# EAGLE design LTC3588_Board (EAGLE 7.1.0)
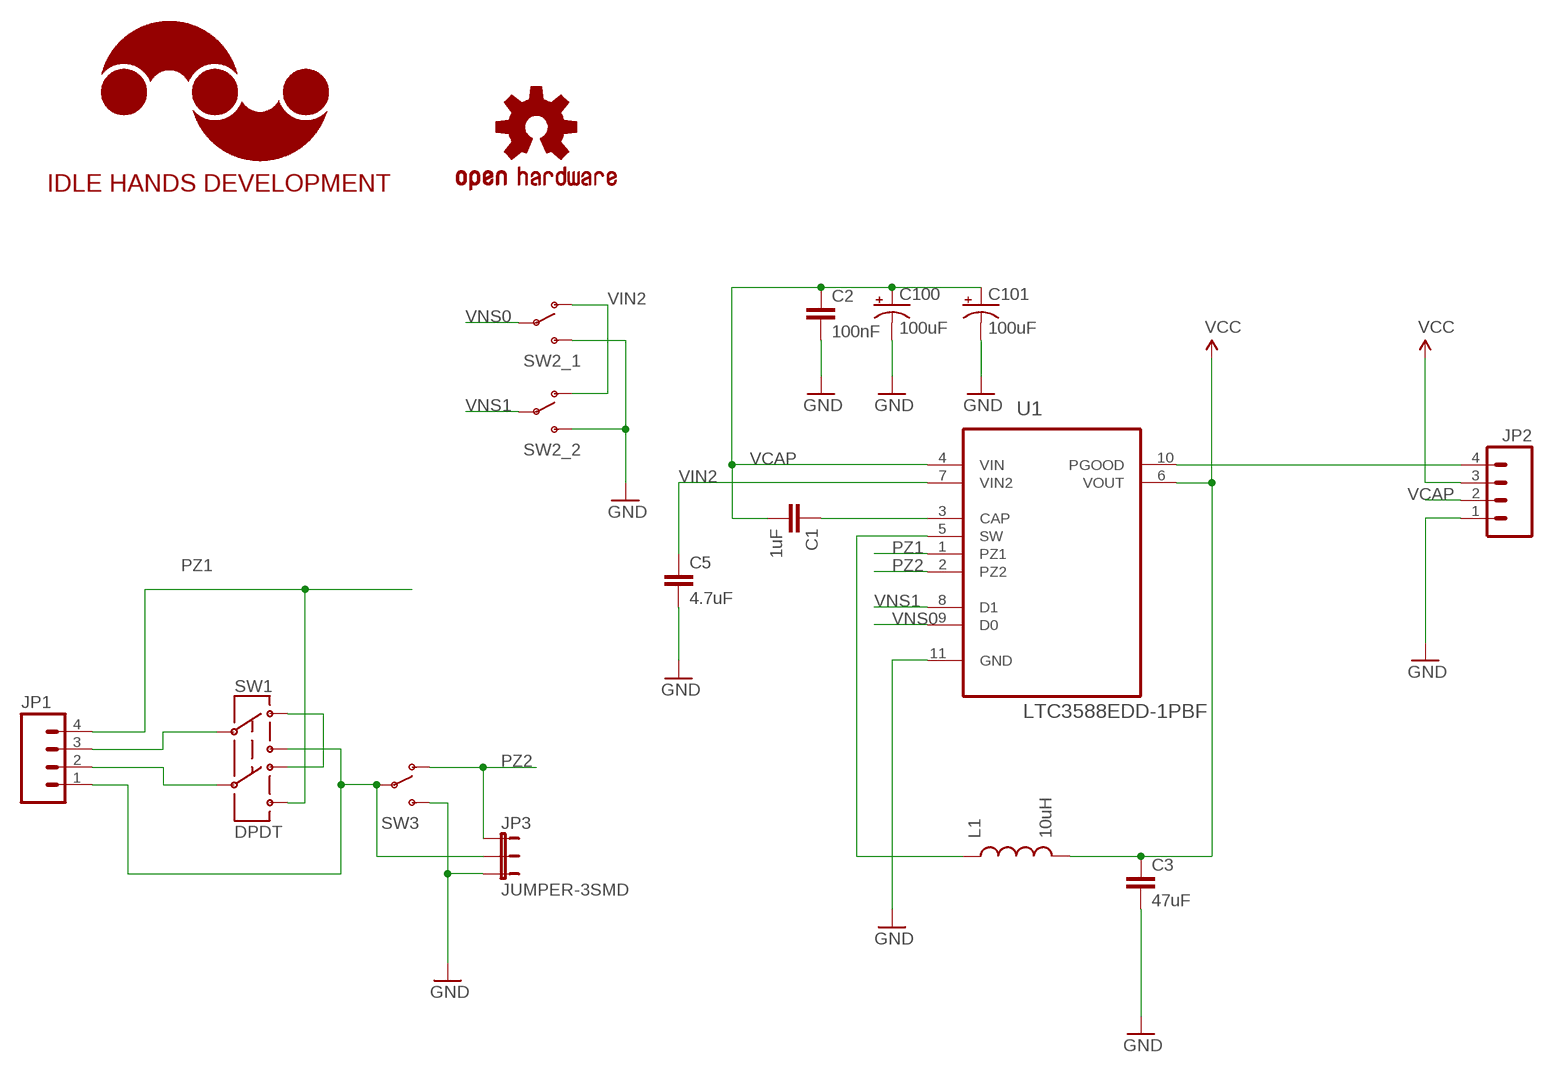
[diagram p0: schematic, sheet 1]

## Parts
C1  1uF  CAP0603-CAP  [0603-CAP]
C2  100nF  CAP0603-CAP  [0603-CAP]
C3  47uF  CAP1206  [1206]
C5  4.7uF  CAP0603-CAP  [0603-CAP]
C100  100uF  CAP_POL7343  [EIA7343]
C101  100uF  CAP_POL7343  [EIA7343]
JP1  M04LOCK  [1X04_LOCK]
JP2  M04LOCK  [1X04_LOCK]
JP3  JUMPER-3SMD  [SJ_3]
L1  10uH  INDUCTOR1210  [1210]
LOGO1  IDLEHANDS_LOGOS  [IHD-LOGO-S]
LOGO2  OSHW-LOGOS  [OSHW-LOGO-S]
SW1  DPDT  SWITCH-DPDTAYZ0202  [AYZ0202]
SW2_1  SWITCH-SPDT  [SWITCH-SPDT-SMD-CK]
SW2_2  SWITCH-SPDT  [SWITCH-SPDT-SMD-CK]
SW3  SWITCH-SPDT  [SWITCH-SPDT-SMD-CK]
U1  LTC3588EDD-1PBF  [DFN300X300X80-11N]

## Nets
GND: C2.2 C3.2 C5.2 C100.C(-) C101.C(-) JP2.1 JP3.3 SW2_1.3(S) SW2_2.3(S) SW3.3(S) U1.11(GND)
N$1: JP1.3 SW1.2
N$2: JP1.2 SW1.5
N$3: SW1.1 SW1.4
N$5: JP1.1 JP3.2 SW1.3 SW3.2(P)
N$13: JP2.4 U1.10(PGOOD)
N$15: C1.1 U1.3(CAP)
N$16: L1.1 U1.5(SW)
PZ1: JP1.4 SW1.6 U1.1(PZ1)
PZ2: JP3.1 SW3.1(O) U1.2(PZ2)
VCAP: C1.2 C2.1 C100.A(+) C101.A(+) JP2.2 U1.4(VIN)
VCC: C3.1 JP2.3 L1.2 U1.6(VOUT)
VIN2: C5.1 SW2_1.1(O) SW2_2.1(O) U1.7(VIN2)
VNS0: SW2_1.2(P) U1.9(D0)
VNS1: SW2_2.2(P) U1.8(D1)

## Library data of the parts
C1-C3 C5 = SparkFun-Passives:CAP: Capacitor Standard 0603 ceramic capacitor, and 0.1" leaded capacitor.
C100 C101 = SparkFun-Passives:CAP_POL: Capacitor Polarized These are standard SMD and PTH capacitors. Normally 10uF, 47uF, and 100uF in electrolytic and tantalum varieties. Always verify the external diameter of the through hole cap, it varies with capacity, voltage, and manufacturer. The EIA devices should be standard.
JP1 JP2 = SparkFun-Connectors:M04: Header 4 Standard 4-pin 0.1" header. Use with straight break away headers (SKU : PRT-00116), right angle break away headers (PRT-00553), swiss pins (PRT-00743), machine pins (PRT-00117), and female headers (PRT-00115). Molex polarized connector foot print use with SKU : PRT-08231 with associated crimp pins and housings. 1MM SMD Version SKU: PRT-10208
JP3 = SparkFun-Passives:JUMPER-3
L1 = SparkFun-Passives:INDUCTOR: Inductors Basic Inductor/Choke - 0603 and 1206. Footprints are not proven and vary greatly between part numbers. SRN6045- 33uH, 20% 1.4A SDR0403-560KL - 56uH, 10%, 500mA RMS/740mA peak
LOGO1 = IdleHandsProject:IDLEHANDS_LOGO: Open Source Hardware Logo This logo indicates the piece of hardware it is found on incorporates a OSHW license and/or adheres to the definition of open source hardware found here: http://freedomdefined.org/OSHW
LOGO2 = SparkFun-Aesthetics:OSHW-LOGO: Open Source Hardware Logo This logo indicates the piece of hardware it is found on incorporates a OSHW license and/or adheres to the definition of open source hardware found here: http://freedomdefined.org/OSHW
SW1 = SparkFun-Electromechanical:SWITCH-DPDT: DPDT Version of the COM-00597; PROD_ID: SWCH-08179
SW2_1 SW2_2 SW3 = SparkFun-Electromechanical:SWITCH-SPDT: SPDT Switch Simple slide switch, Spark Fun Electronics SKU : COM-00102 DPDT SMT slide switch, AYZ0202, SWCH-08179
U1 = LTC_By_element14_Batch_1:LTC3588EDD-1PBF: Piezoelectric Energy Harvesting Power Supply; MPN: LTC3588EDD-1#PBF; OC_FARNELL: 1839153; OC_NEWARK: 63R1665; PACKAGE: DFN-10; SUPPLIER: Linear Technology

## Board
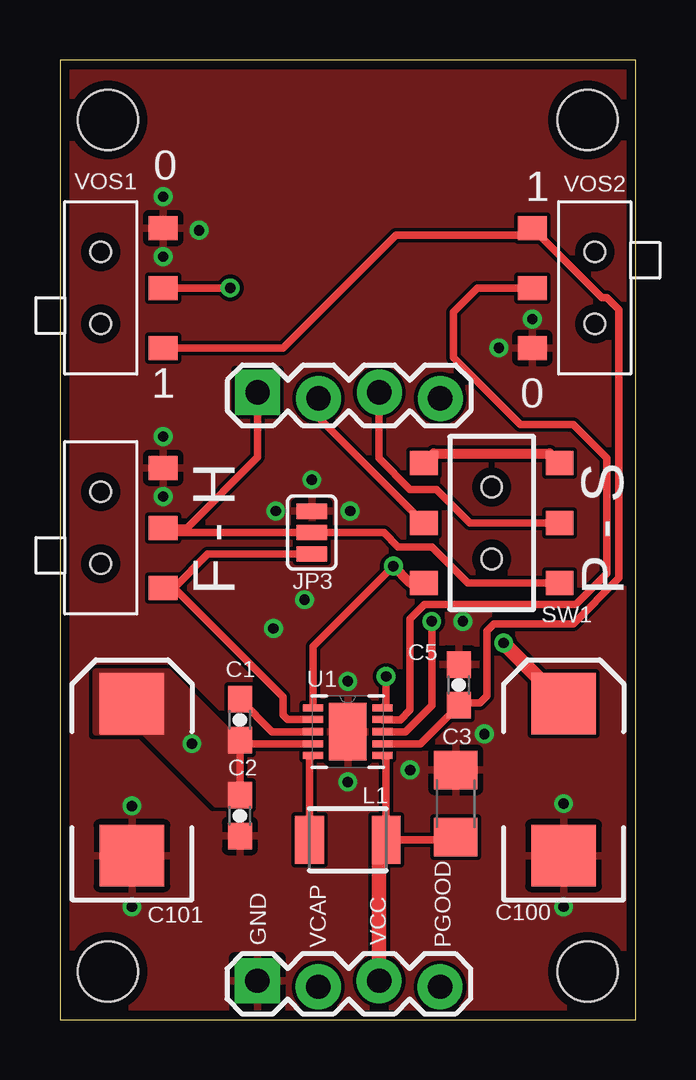
[diagram p1: board, top side]
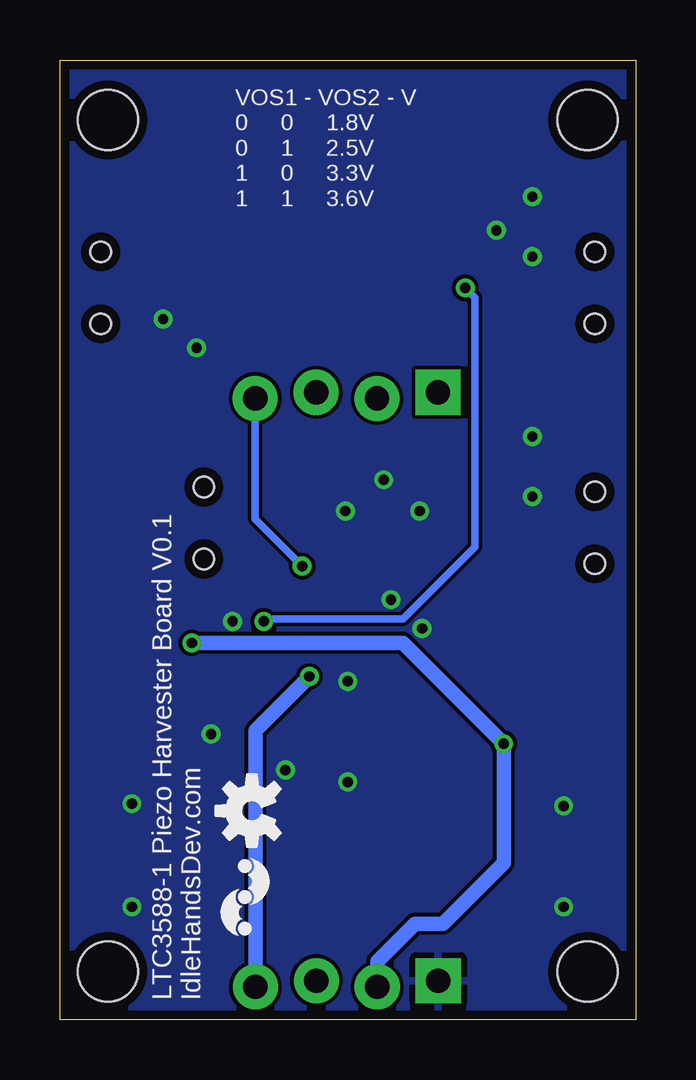
[diagram p2: board, bottom side, seen from below]

Size 24 x 40 mm. Coordinates in mm from the lower left corner, seen from the top.
Outline: 0,0 24,0 24,40 0,40 0,0
Copper layers (1*16): Top 0.0356mm / dielectric 1.5011mm / Bottom 0.0356mm
Design rules "LaenPCBOrder": minimum track width 6mil, minimum drill 13mil, track to track 6mil, track to pad 6mil, pad to pad 6mil, via to via 6mil, smd to smd 6mil, copper to edge 15mil, drill to drill 6mil, minimum pad ring 7mil, minimum via ring 7mil, stop-mask expansion 3mil, vias tented up to drill 0mil, thermal gap 10mil
Holes 2.5 mm at 2,37.5 2,2 22,2 22,37.5

### Footprints (pad centres in the part's own frame; a part is rotated, then mirrored left to right if it is on the bottom)
0603-CAP = smd 1.1 x 1: 1 -0.85,0; 2 0.85,0
1206 = smd 1.6 x 1.8: 1 -1.4,0; 2 1.4,0
EIA7343 = smd 2.55 x 2.7: A 3.17,0; C -3.17,0
1X04_LOCK = drill 1.016 pad 1.88 square: 1 0,0.127 | drill 1.016 pad 1.88: 2 2.54,-0.127; 3 5.08,0.127; 4 7.62,-0.127
SJ_3 = smd 0.635 x 1.27: 1 -0.889,0; 2 0,0; 3 0.889,0
1210 = smd 1.2 x 2: 1 -1.6,0; 2 1.6,0
AYZ0202 = smd 1 x 1.15: 1 -2.5,2.825; 2 0,2.825; 3 2.5,2.825; 4 -2.5,-2.825; 5 0,-2.825; 6 2.5,-2.825 | hole 0.85: 1.5,0; -1.5,0
SWITCH-SPDT-SMD-CK = smd 1 x 1.2: 1 -2.5,-1.6; 2 0,-1.6; 3 2.5,-1.6 | hole 0.85: 1.5,1; -1.5,1
DFN300X300X80-11N = smd 0.813 x 0.305: 1 -1.448,0.991; 2 -1.448,0.508; 3 -1.448,0; 4 -1.448,-0.508; 5 -1.448,-0.991; 6 1.448,-0.991; 7 1.448,-0.508; 8 1.448,0; 9 1.448,0.508; 10 1.448,0.991 | smd 1.549 x 2.388: 11 0,0

### Placement (x,y rotation side)
C1  7.5,12.5 270 top
C2  7.5,8.5 270 top
C3  16.5,9 90 top
C5  16.63,13.95 90 top
C100  21,10 90 top
C101  3,10 90 top
JP1  8.24,26.02 0 top
JP2  8.23,1.49 0 top
JP3  10.5,20.3 90 top
L1  12,7.5 0 top
LOGO1  16.3,5.1 270 bottom
LOGO2  16,8.7 90 bottom
SW1  18,20.7 270 top
SW2_1  21.3,30.5 270 top
SW2_2  2.7,30.5 90 top
SW3  2.7,20.5 90 top
U1  12,12 0 top

### Tracks (layer width: path | path; a pad name or v marks a point on that pad's centre or on a via)
GND  (via drill 0.43)
  other vias: 12,9.9 12,14.1 17.7,11.9 14.6,10.4 16.8,16.6 21,9 21,4.7 3,4.7 3,8.9 4.3,24.3 4.3,21.8 4.3,34.3 5.8,32.9 4.3,31.8 18.3,28 19.7,29.2 10.5,22.5 9,21.2 8.9,16.3 10.2,17.5 12.1,21.2
  pour Top (rank 6): 0,0 0,40 24,40 24,0
  pour Bottom (rank 6): 0,0 0,40 24,40 24,0
N$1
  Top 0.305: JP1.3 13.3,26.13 13.3,23.4 14.6,22.1 15.7,22.1 17.1,20.7 SW1.2
N$2
  Top 0.305: SW1.5 10.78,25.09 JP1.2
N$3
  Top 0.406: SW1.4 15.57,23.6 20.43,23.6 SW1.1
N$5
  Top 0.305: JP1.1 8.24,23.44 5.3,20.5 SW3.2 4.5,20.3 JP3.2 13.5,20.3 14.1,19.7 15.5,19.7 17,18.2 SW1.3
N$13  (via drill 0.43)
  Top 0.305: v13.6,14.3 13.6,13.14 U1.10
  Bottom 0.61: JP2.4 15.85,12.05 v13.6,14.3
N$15
  Top 0.305: U1.3 8.85,12 C1.1
N$16
  Top 0.305: U1.5 10.4,10.86 L1.1
PZ1  (via drill 0.43)
  Top 0.305: U1.1 10.55,15.55 v13.9,18.9
  Top 0.406: SW1.6 14.6,18.2 v13.9,18.9
  Bottom 0.305: v13.9,18.9 15.86,20.86 JP1.4
PZ2
  Top 0.305: U1.2 9.49,12.51 9.3,12.7 9.3,13.45 4.75,18 | JP3.1 6.16,19.41 4.75,18 | 4.75,18 SW3.1
VCAP  (via drill 0.43)
  Top 0.305: U1.4 7.66,11.49 C1.2 C2.1
  Top 0.61: C100.A 18.5,15.67 v18.5,15.7
  Bottom 0.61: JP2.2 10.77,2.43 9.2,4 8.03,4 5.5,6.53 v5.5,11.5 9.7,15.7 v18.5,15.7
  pour Top (no thermals): 7.5,9 6.5,9 5,10.5 3.5,12 1.5,12 1.5,14.5 4.5,14.5 7,12 7.5,11.5
VCC
  Top 0.305: U1.6 13.6,10.86 L1.2 16.4,7.5 C3.1
  Top 0.61: L1.2 13.31,7.21 JP2.3
VIN2
  Top 0.305: U1.7 15.02,11.49 C5.1 16.73,13.2 17.5,13.2 17.8,13.5 17.8,16.2 18.1,16.5 21.4,16.5 23.3,18.4 23.3,29.6 22.8,30.1 22.6,30.1 SW2_1.1 19.4,32.7 14,32.7 9.3,28 SW2_2.1
VNS0
  Top 0.305: U1.9 14.2,12.5 14.6,12.9 14.6,16.7 15.2,17.3 21.5,17.3 22.8,18.6 22.8,23.4 21.4,24.8 19.2,24.8 16.4,27.6 16.4,29.5 17.4,30.5 SW2_1.2
VNS1  (via drill 0.43)
  Top 0.305: U1.8 14.4,12 15.5,13.1 v15.5,16.6 | v7.1,30.5 SW2_2.2
  Bottom 0.305: v15.5,16.6 15.4,16.7 9.7,16.7 6.7,19.7 6.7,30.1 v7.1,30.5

### Text on the board
tNames: VOS1 | 0 | 1 | VOS2 | 1 | 0 | F - H | P - S | GND | VCAP | VCC | PGOOD
bNames: VOS1 - VOS2 - V / 0 0 1.8V / 0 1 2.5V / 1 0 3.3V / 1 1 3.6V | LTC3588-1 Piezo Harvester Board V0.1 / IdleHandsDev.com